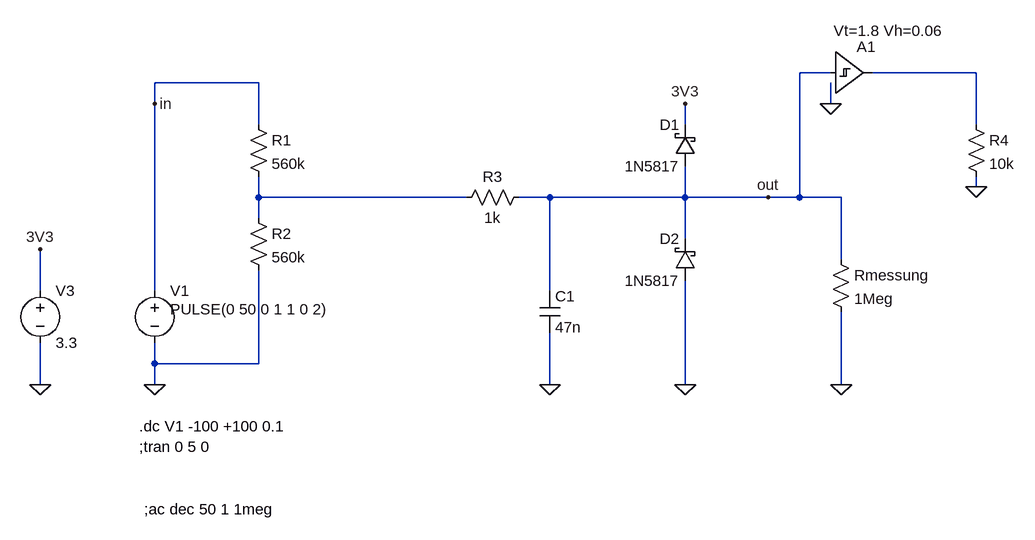
[diagram p0: schematic DigitalEingang.asc]
DigitalEingang.asc, the LTspice schematic file:
Version 4
SHEET 1 1468 680
WIRE 768 -176 720 -176
WIRE 992 -176 832 -176
WIRE -112 -160 -272 -160
WIRE -272 -128 -272 -160
WIRE 768 -128 768 -160
WIRE -112 -96 -112 -160
WIRE 544 -96 544 -128
WIRE 992 -96 992 -176
WIRE 992 0 992 -16
WIRE -112 16 -112 -16
WIRE 208 16 -112 16
WIRE 336 16 288 16
WIRE 544 16 544 -32
WIRE 544 16 336 16
WIRE 672 16 544 16
WIRE 720 16 720 -176
WIRE 720 16 672 16
WIRE 784 16 720 16
WIRE -112 48 -112 16
WIRE 544 80 544 16
WIRE 784 112 784 16
WIRE -448 160 -448 96
WIRE -272 160 -272 -128
WIRE 336 160 336 16
WIRE -272 272 -272 240
WIRE -112 272 -112 128
WIRE -112 272 -272 272
WIRE -448 304 -448 240
WIRE -272 304 -272 272
WIRE 336 304 336 224
WIRE 544 304 544 144
WIRE 784 304 784 192
FLAG -272 304 0
FLAG 672 16 out
FLAG -272 -128 in
FLAG 784 304 0
FLAG 336 304 0
FLAG -448 304 0
FLAG -448 96 3V3
FLAG 544 -128 3V3
FLAG 544 304 0
FLAG 768 -128 0
FLAG 992 0 0
SYMBOL voltage -272 144 R0
WINDOW 123 24 124 Left 2
WINDOW 39 0 0 Left 0
WINDOW 3 24 44 Left 2
SYMATTR InstName V1
SYMATTR Value PULSE(0 50 0 1 1 0 2)
SYMBOL res -128 -112 R0
SYMATTR InstName R1
SYMATTR Value 560k
SYMBOL res -128 32 R0
SYMATTR InstName R2
SYMATTR Value 560k
SYMBOL res 768 96 R0
SYMATTR InstName Rmessung
SYMATTR Value 1Meg
SYMBOL res 304 0 R90
WINDOW 0 0 56 VBottom 2
WINDOW 3 32 56 VTop 2
SYMATTR InstName R3
SYMATTR Value 1k
SYMBOL cap 320 160 R0
SYMATTR InstName C1
SYMATTR Value 47n
SYMBOL voltage -448 144 R0
WINDOW 123 0 0 Left 0
WINDOW 39 0 0 Left 0
SYMATTR InstName V3
SYMATTR Value 3.3
SYMBOL schottky 560 -32 R180
WINDOW 0 24 64 Left 2
WINDOW 3 24 0 Left 2
SYMATTR InstName D1
SYMATTR Value 1N5817
SYMATTR Description Diode
SYMATTR Type diode
SYMBOL schottky 560 144 R180
WINDOW 0 24 64 Left 2
WINDOW 3 24 0 Left 2
SYMATTR InstName D2
SYMATTR Value 1N5817
SYMATTR Description Diode
SYMATTR Type diode
SYMBOL Digital\\schmtbuf 768 -240 R0
WINDOW 3 5 0 Left 2
SYMATTR InstName A1
SYMATTR Value Vt=1.8 Vh=0.06
SYMBOL res 976 -112 R0
SYMATTR InstName R4
SYMATTR Value 10k
TEXT -296 368 Left 2 !.dc V1 -100 +100 0.1
TEXT -296 400 Left 2 !;tran 0 5 0
TEXT -288 496 Left 2 !;ac dec 50 1 1meg

The netlist it stands for:
* DigitalEingang.asc
V1 in 0 PULSE(0 50 0 1 1 0 2)
R1 in N002 560k
R2 N002 0 560k
Rmessung out 0 1Meg
R3 out N002 1k
C1 out 0 47n
V3 3V3 0 3.3
D1 out 3V3 1N5817
D2 0 out 1N5817
A1 out 0 0 0 0 0 N001 0 SCHMITT Vt=1.8 Vh=0.06
R4 N001 0 10k
.model D D
.lib standard.dio
.dc V1 -100 +100 0.1
;tran 0 5 0
;ac dec 50 1 1meg
.backanno
.end